# Altium schematic sheet Clock.SchDoc
size A3
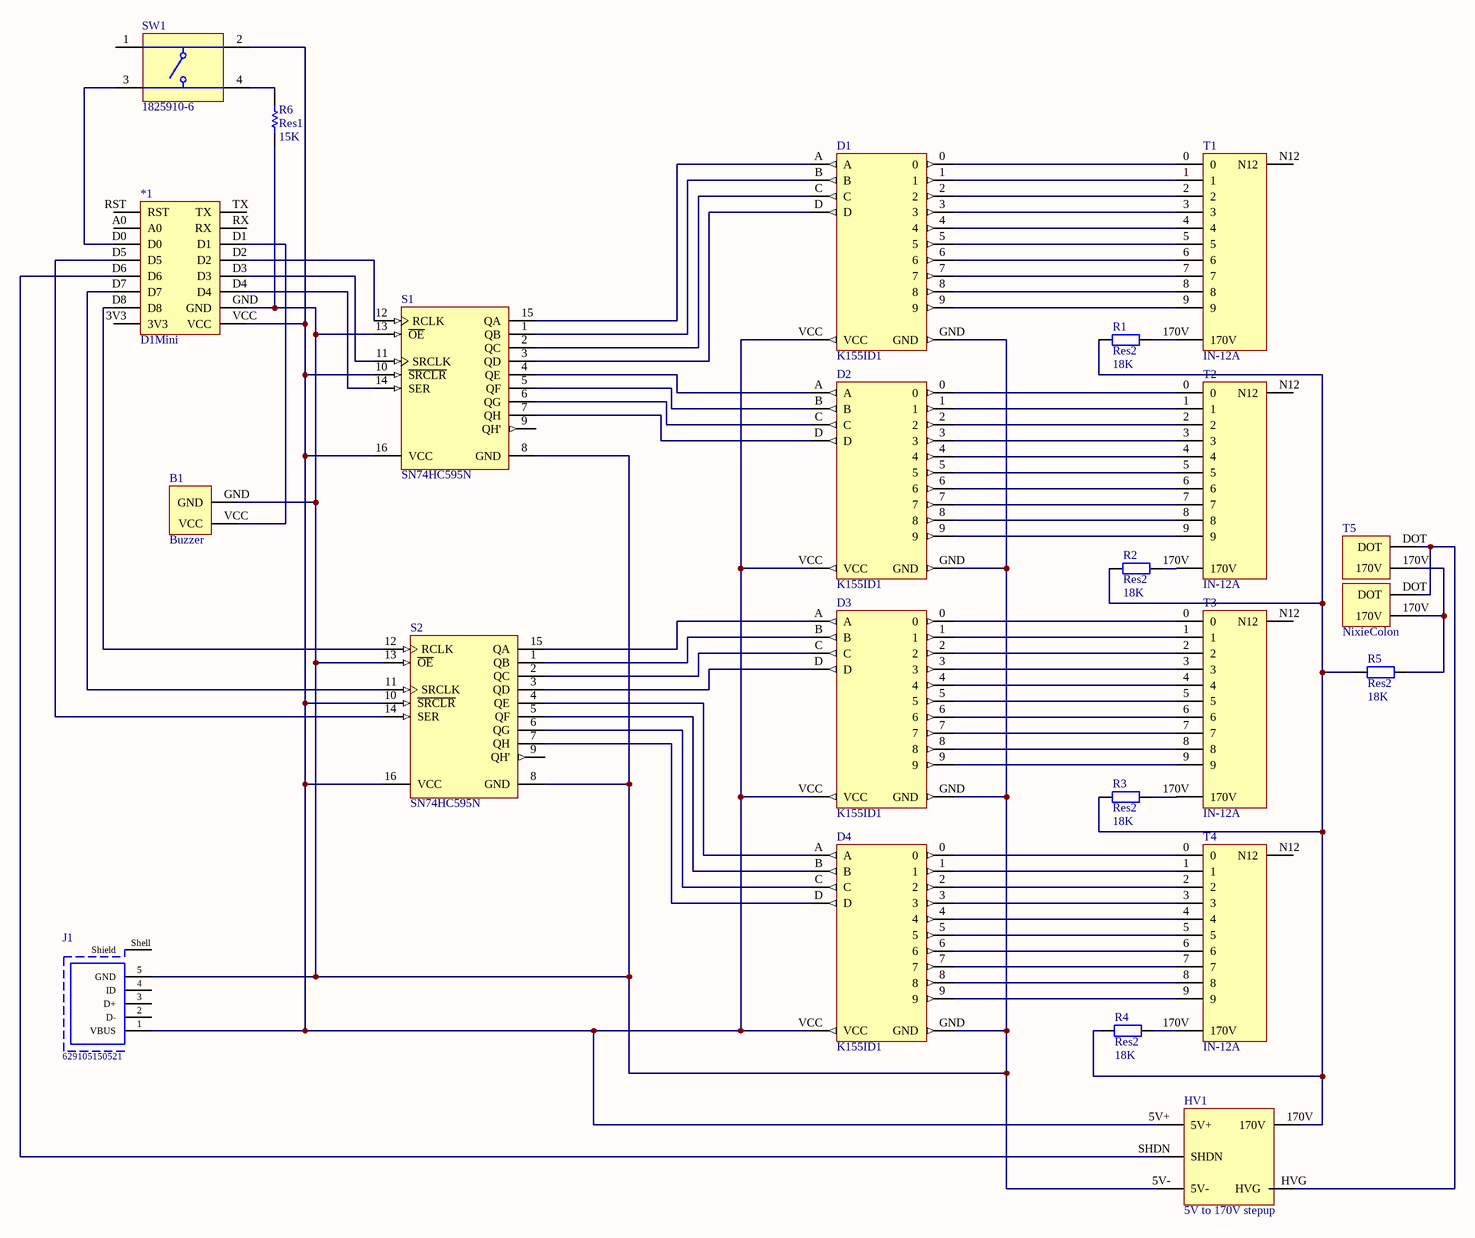
[diagram p0: Clock.SchDoc]

## Parts
*1  D1Mini  [DIP16-WemosD1Mini]
B1  Buzzer  [Buzzer]
D1  K155ID1  [DIP16]
D2  K155ID1  [DIP16]
D3  K155ID1  [DIP16]
D4  K155ID1  [DIP16]
HV1  5V to 170V stepup  [5V to 170V stepup]
J1  629105150521  [629105150521]
R1  Res2  value 18K  [AXIAL-0.6]
R2  Res2  value 18K  [AXIAL-0.6]
R3  Res2  value 18K  [AXIAL-0.6]
R4  Res2  value 18K  [AXIAL-0.6]
R5  Res2  value 18K  [AXIAL-0.6]
R6  Res1  value 15K  [AXIAL-0.3]
S1  SN74HC595N  [N0016A]
S2  SN74HC595N  [N0016A]
SW1  1825910-6  [TECO-1825910-6_V]
T1  IN-12A  [IN-12A]
T2  IN-12A  [IN-12A]
T3  IN-12A  [IN-12A]
T4  IN-12A  [IN-12A]
T5  NixieColon  [COLON IN-12A]

## Nets
Net*1_D0: *1.D0 SW1.3
Net*1_D1: *1.D1 B1.VCC
Net*1_D2: *1.D2 S1.12(RCLK)
Net*1_D3: *1.D3 S1.11(SRCLK)
Net*1_D4: *1.D4 S1.14(SER)
Net*1_D5: *1.D5 S2.14(SER)
Net*1_D6: *1.D6 HV1.SHDN
Net*1_D7: *1.D7 S2.11(SRCLK)
Net*1_D8: *1.D8 S2.12(RCLK)
Net*1_GND: *1.GND B1.GND D1.GND D2.GND D3.GND D4.GND HV1.5V- J1.5(GND) R6.1 S1.8(GND) S1.13(~{OE}) S2.8(GND) S2.13(~{OE})
Net*1_VCC: *1.VCC D1.VCC D2.VCC D3.VCC D4.VCC HV1.5V+ J1.1(VBUS) S1.10(~{SRCLR}) S1.16(VCC) S2.10(~{SRCLR}) S2.16(VCC) SW1.2
NetD1_0: D1.0 T1.0
NetD1_1: D1.1 T1.1
NetD1_2: D1.2 T1.2
NetD1_3: D1.3 T1.3
NetD1_4: D1.4 T1.4
NetD1_5: D1.5 T1.5
NetD1_6: D1.6 T1.6
NetD1_7: D1.7 T1.7
NetD1_8: D1.8 T1.8
NetD1_9: D1.9 T1.9
NetD1_A: D1.A S1.15(QA)
NetD1_B: D1.B S1.1(QB)
NetD1_C: D1.C S1.2(QC)
NetD1_D: D1.D S1.3(QD)
NetD2_0: D2.0 T2.0
NetD2_1: D2.1 T2.1
NetD2_2: D2.2 T2.2
NetD2_3: D2.3 T2.3
NetD2_4: D2.4 T2.4
NetD2_5: D2.5 T2.5
NetD2_6: D2.6 T2.6
NetD2_7: D2.7 T2.7
NetD2_8: D2.8 T2.8
NetD2_9: D2.9 T2.9
NetD2_A: D2.A S1.4(QE)
NetD2_B: D2.B S1.5(QF)
NetD2_C: D2.C S1.6(QG)
NetD2_D: D2.D S1.7(QH)
NetD3_0: D3.0 T3.0
NetD3_1: D3.1 T3.1
NetD3_2: D3.2 T3.2
NetD3_3: D3.3 T3.3
NetD3_4: D3.4 T3.4
NetD3_5: D3.5 T3.5
NetD3_6: D3.6 T3.6
NetD3_7: D3.7 T3.7
NetD3_8: D3.8 T3.8
NetD3_9: D3.9 T3.9
NetD3_A: D3.A S2.15(QA)
NetD3_B: D3.B S2.1(QB)
NetD3_C: D3.C S2.2(QC)
NetD3_D: D3.D S2.3(QD)
NetD4_0: D4.0 T4.0
NetD4_1: D4.1 T4.1
NetD4_2: D4.2 T4.2
NetD4_3: D4.3 T4.3
NetD4_4: D4.4 T4.4
NetD4_5: D4.5 T4.5
NetD4_6: D4.6 T4.6
NetD4_7: D4.7 T4.7
NetD4_8: D4.8 T4.8
NetD4_9: D4.9 T4.9
NetD4_A: D4.A S2.4(QE)
NetD4_B: D4.B S2.5(QF)
NetD4_C: D4.C S2.6(QG)
NetD4_D: D4.D S2.7(QH)
NetHV1_170V: HV1.170V R1.2 R2.2 R3.2 R4.2 R5.2
NetHV1_HVG: HV1.HVG T5.DOT
NetR1_1: R1.1 T1.170V
NetR2_1: R2.1 T2.170V
NetR3_1: R3.1 T3.170V
NetR4_1: R4.1 T4.170V
NetR5_1: R5.1 T5.170V
NetR6_2: R6.2 SW1.4

Not connected (* = marked no-connect by the designer): *1 3V3 A0 RST RX TX; J1 2(D-) 3(D+) 4(ID) Shell(Shield); S1 9(QH'); S2 9(QH'); SW1 1; T1 N12; T2 N12; T3 N12; T4 N12

## Notes on the sheet
- Title
- Size:
- Date:
- A3
- Number:
- Time:
- Revision:
- Sheet
- of
- File:

## Library data of the parts
J1 = CMP-1502-03252-1: Micro USB 2.0 Type B Receptacle WR-COM, Horizontal, SMT, with Pegs, High Current at Pin 1 & Pin 5; Manufacturer: Wurth Elektronik; Contact Resistance: 30mOhm; Rated Current: 3A; Working Voltage: 30VAC; Package Reference: 629105150521; Mounting Technology: SMT; Connector Type: MicroUSB2.0TypeB; Operating Temperature: -40to85degC; Orientation: Horizontal; Manufacturer URL: http://www.we-online.de; Datasheet URL: https://katalog.we-online.de/em/datasheet/629105150521.pdf; Part Number: 629105150521; Packaging: TapeandReel; Gender: Receptacle; Publisher: WurthElektronik
R1-R5 = Res2: Resistor; Published: 8-Jun-2000; LatestRevisionDate: 17-Jul-2002; LatestRevisionNote: Re-released for DXP Platform.; PackageReference: AXIAL-0.4; Publisher: Altium Limited; PackageDescription: Axial Device, Thru-Hole; 2 Leads; 0.4 in Pin Spacing
R6 = Res1: Resistor; Published: 8-Jun-2000; LatestRevisionDate: 17-Jul-2002; LatestRevisionNote: Re-released for DXP Platform.; PackageReference: AXIAL-0.3; Publisher: Altium Limited; PackageDescription: Axial Device, Thru-Hole; 2 Leads; 0.3 in Pin Spacing
S1 S2 = CMP-0780-00137-3: 8-Bit Shift Registers With 3-State Output Registers, N0016A, TUBE; Manufacturer: Texas Instruments; F @ Nom Voltage(Max)(Mhz): 28; Input Type: CMOS; Bits: 8; VCC(Min)(V): 2; 3-State Output: Yes; ICC @ Nom Voltage(Max)(mA): 0.08; VCC(Max)(V): 6; tpd @ Nom Voltage(Max)(ns): 34; Rating: Military; Technology Family: HC; Output Drive (IOL/IOH)(Max)(mA): 7.8/-7.8; Code_JEDEC: MS-001; Output Type: CMOS; Operating Temperature Range(C): -40 to 85; Voltage(Nom)(V): 6; Generic Part Number: SN74HC595; DatasheetVersion: SCLS041H; PackageReference: N0016A; PackageVersion: http://www.ti.com/lit/ml/mpdi002c/mpdi002c.pdf
SW1 = CMP-1684-00021-1: Tact Switch, SPST-NO, 0.05 A, -35 to 85 degC, 4-Pin THD, RoHS, Bulk; Manufacturer: TE Connectivity; Maximum Contact Resistance: 100mOhm; Mechanical Life: 100000Cycles; Bushing Type: Unthreaded; Switch Configuration: OFF(ON); Maximum DC Voltage Rating: 24V; Contact Rating @ Voltage: 0.05A@24VDC; Actuator Color: Black; Body Orientation: Straight; Function: MomentaryContact; Illumination: N/R; Actuator Style: RoundButton; Actuator Material: PolybutyleneTerephthalate; Dielectric Strength: 500VAC; Pole Throw Configuration: SPST; Actuator Length: 1.4mm; Product Weight: N/A; Contact Material: CopperAlloy; Housing Material: N/A; Terminal Type: PCPins; Minimum Insulation Resistance: 100MOhm; Package Description: 4-Pin Through Hole Device, Body 5.99 x 5.99 mm, Pitch 6.5 mm; Part No: 1825910-6; Package Reference: THD; Base Material: N/A; Manufacturer URL: http://www.te.com; Contact Plating: Silver; RoHS: Yes; Datasheet Version: Rev. C9; Electrical Life: 100000Cycles; Maximum AC Voltage Rating: N/A; Thread Size: N/R; Operating Temperature: -35to85C; Mounting: ThroughHole; Dimension: 5.99x5mm; Datasheet URL: http://www.te.com/commerce/DocumentDelivery/DDEController?Action=showdoc&DocId=Customer+Drawing%7F1825910%7FC9%7Fpdf%7FEnglish%7FENG_CD_1825910_C9.pdf%7F1825910-6; Family: 1825910; Seal Location: N/A; Seal Description: N/A; Packaging: N/A